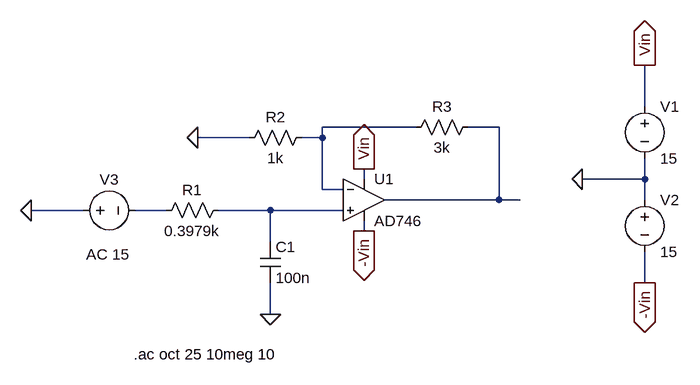
[diagram p0: schematic ФНЧ неинв.asc]
ФНЧ неинв.asc, the LTspice schematic file:
Version 4
SHEET 1 880 680
WIRE 608 32 608 -32
WIRE 256 64 112 64
WIRE 384 64 336 64
WIRE 0 80 -80 80
WIRE 112 80 112 64
WIRE 112 80 80 80
WIRE 176 144 176 128
WIRE 608 144 608 112
WIRE 608 144 512 144
WIRE 112 160 112 80
WIRE 144 160 112 160
WIRE 384 176 384 64
WIRE 384 176 208 176
WIRE 416 176 384 176
WIRE 608 176 608 144
WIRE -256 192 -336 192
WIRE -128 192 -176 192
WIRE 32 192 -48 192
WIRE 144 192 32 192
WIRE 176 224 176 208
WIRE 32 240 32 192
WIRE 608 304 608 256
WIRE 32 352 32 304
FLAG -80 80 0
FLAG 512 144 0
FLAG 608 -32 Vin
IOPIN 608 -32 Out
FLAG 608 304 -Vin
IOPIN 608 304 Out
FLAG 176 128 Vin
IOPIN 176 128 Out
FLAG 176 224 -Vin
IOPIN 176 224 Out
FLAG 32 352 0
FLAG -336 192 0
SYMBOL Opamps\\AD746 176 112 R0
SYMATTR InstName U1
SYMBOL res -32 176 R90
WINDOW 0 0 56 VBottom 2
WINDOW 3 32 56 VTop 2
SYMATTR InstName R1
SYMATTR Value 0.3979k
SYMBOL res 96 64 R90
WINDOW 0 0 56 VBottom 2
WINDOW 3 32 56 VTop 2
SYMATTR InstName R2
SYMATTR Value 1k
SYMBOL res 352 48 R90
WINDOW 0 0 56 VBottom 2
WINDOW 3 32 56 VTop 2
SYMATTR InstName R3
SYMATTR Value 3k
SYMBOL voltage 608 16 R0
SYMATTR InstName V1
SYMATTR Value 15
SYMBOL voltage 608 160 R0
SYMATTR InstName V2
SYMATTR Value 15
SYMBOL cap 16 240 R0
SYMATTR InstName C1
SYMATTR Value 100n
SYMBOL voltage -272 192 R270
WINDOW 0 32 56 VTop 2
WINDOW 3 -144 56 VBottom 2
WINDOW 123 -52 54 VBottom 2
WINDOW 39 0 0 Left 0
SYMATTR InstName V3
SYMATTR Value ""
SYMATTR Value2 AC 15
TEXT -178 414 Left 2 !.ac oct 25 10meg 10

The netlist it stands for:
* ФНЧ неинв.asc
XU1 N004 N001 Vin -Vin N002 AD746  ; pins In+ In- V+ V- OUT
R1 N004 N003 0.3979k
R2 N001 0 1k
R3 N002 N001 3k
V1 Vin 0 15
V2 0 -Vin 15
C1 N004 0 100n
V3 0 N003 AC 15
.ac oct 25 10meg 10
.backanno
.end